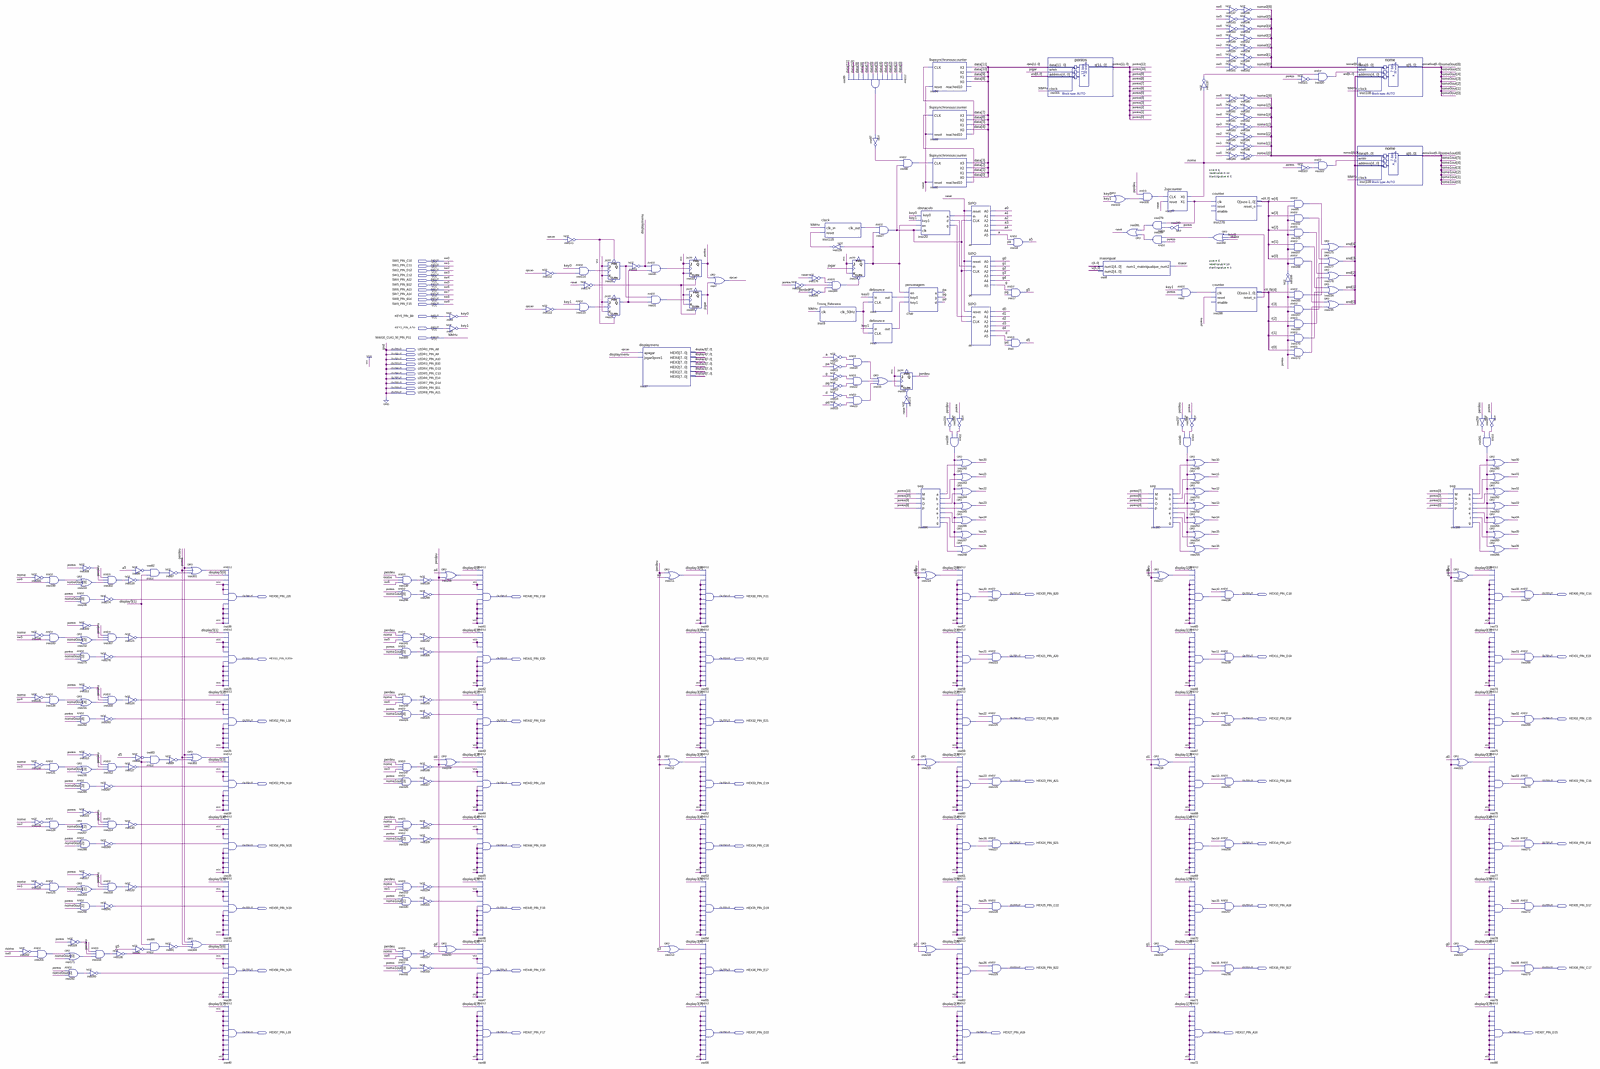
[diagram p0: schematic sheet, whole]
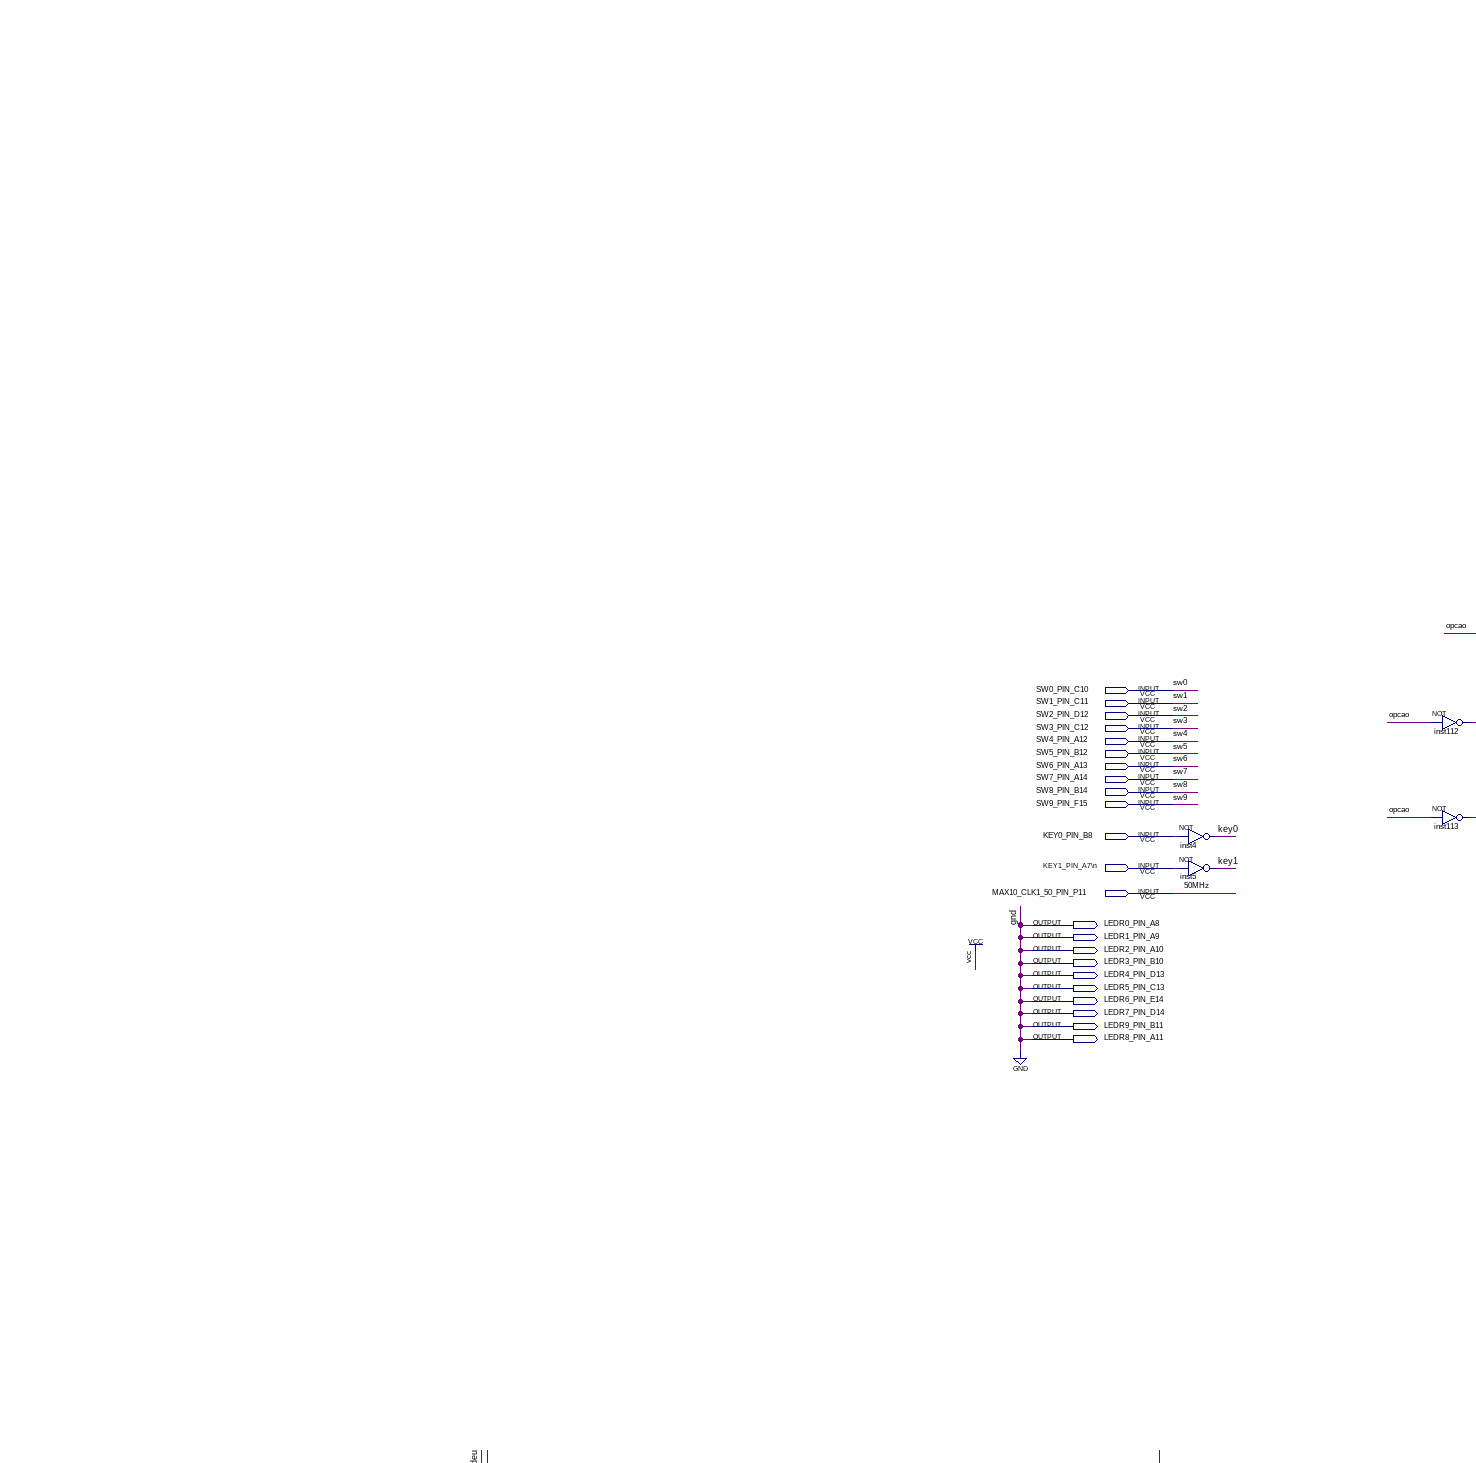
[diagram p1: schematic sheet, upper left part]
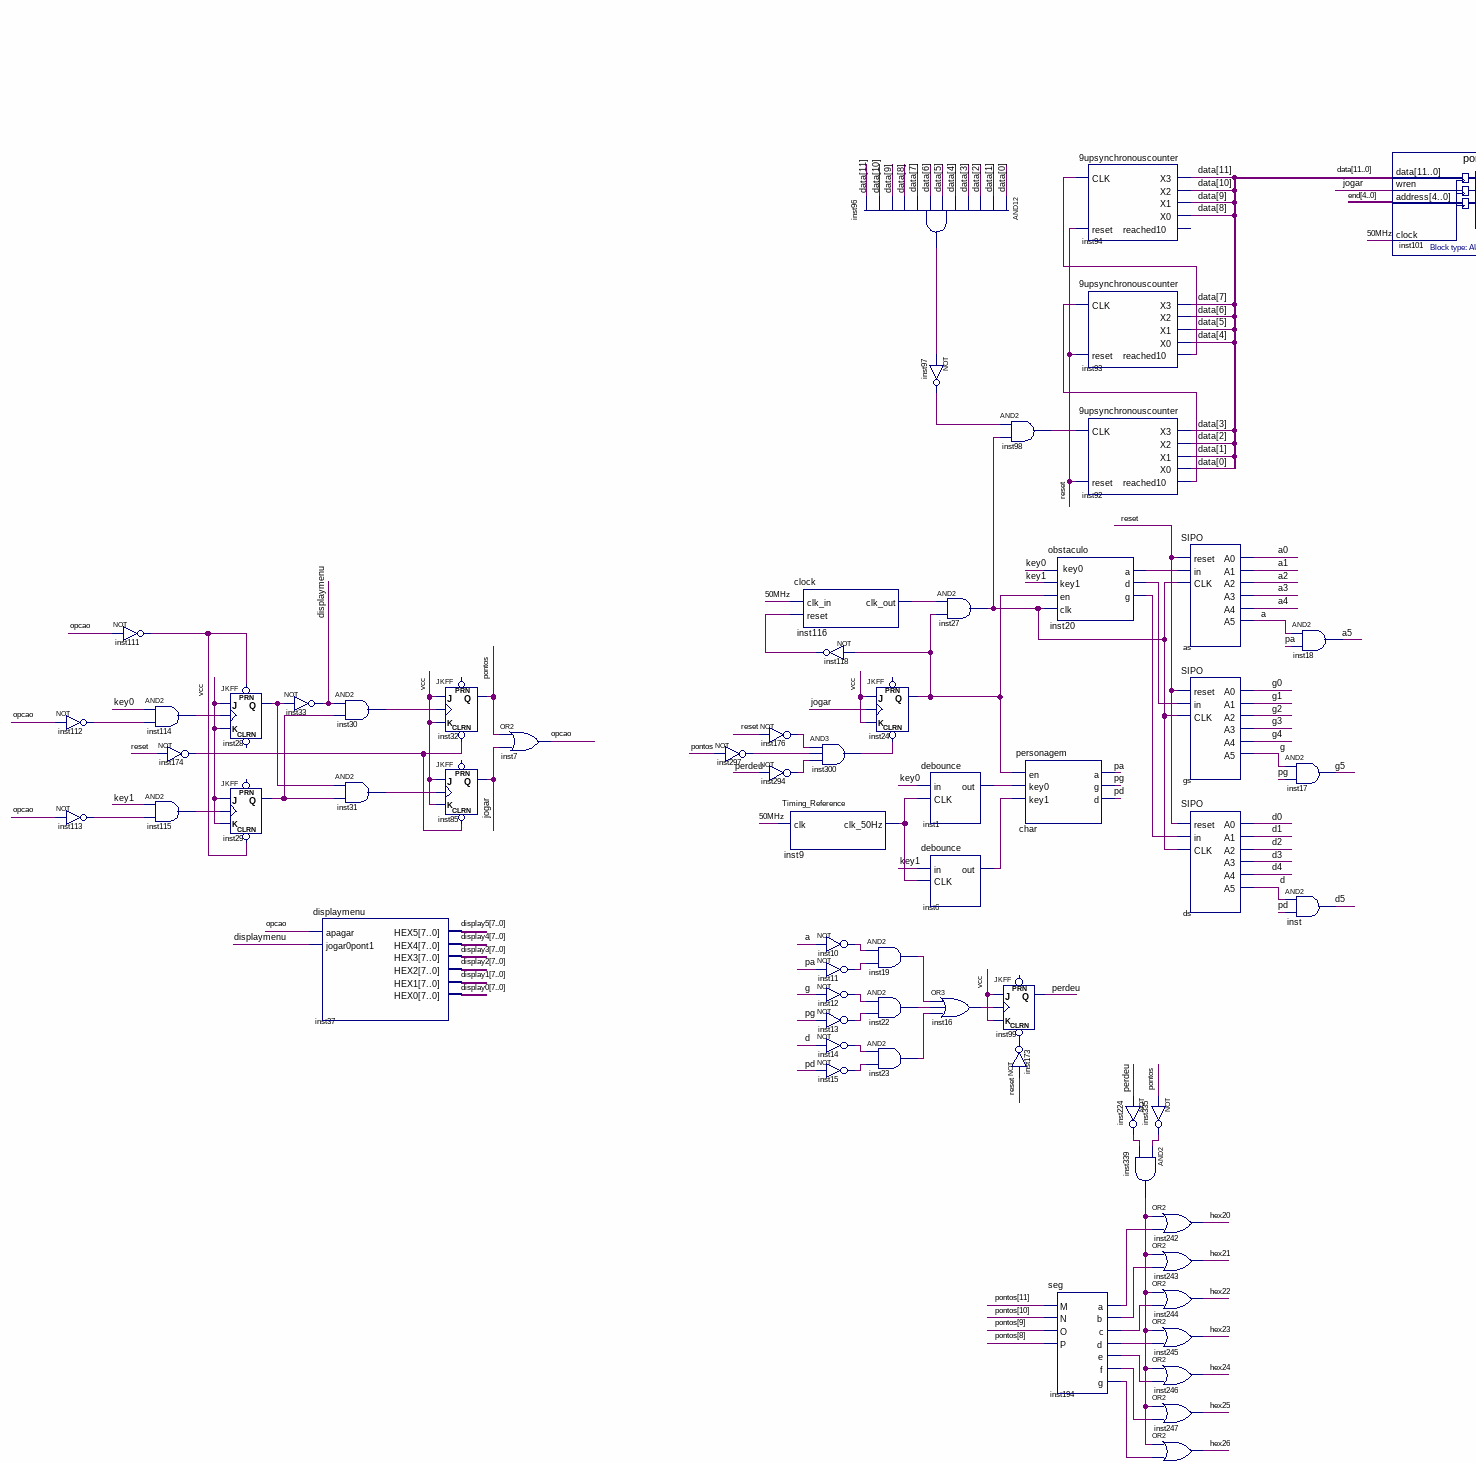
[diagram p2: schematic sheet, upper centre part]
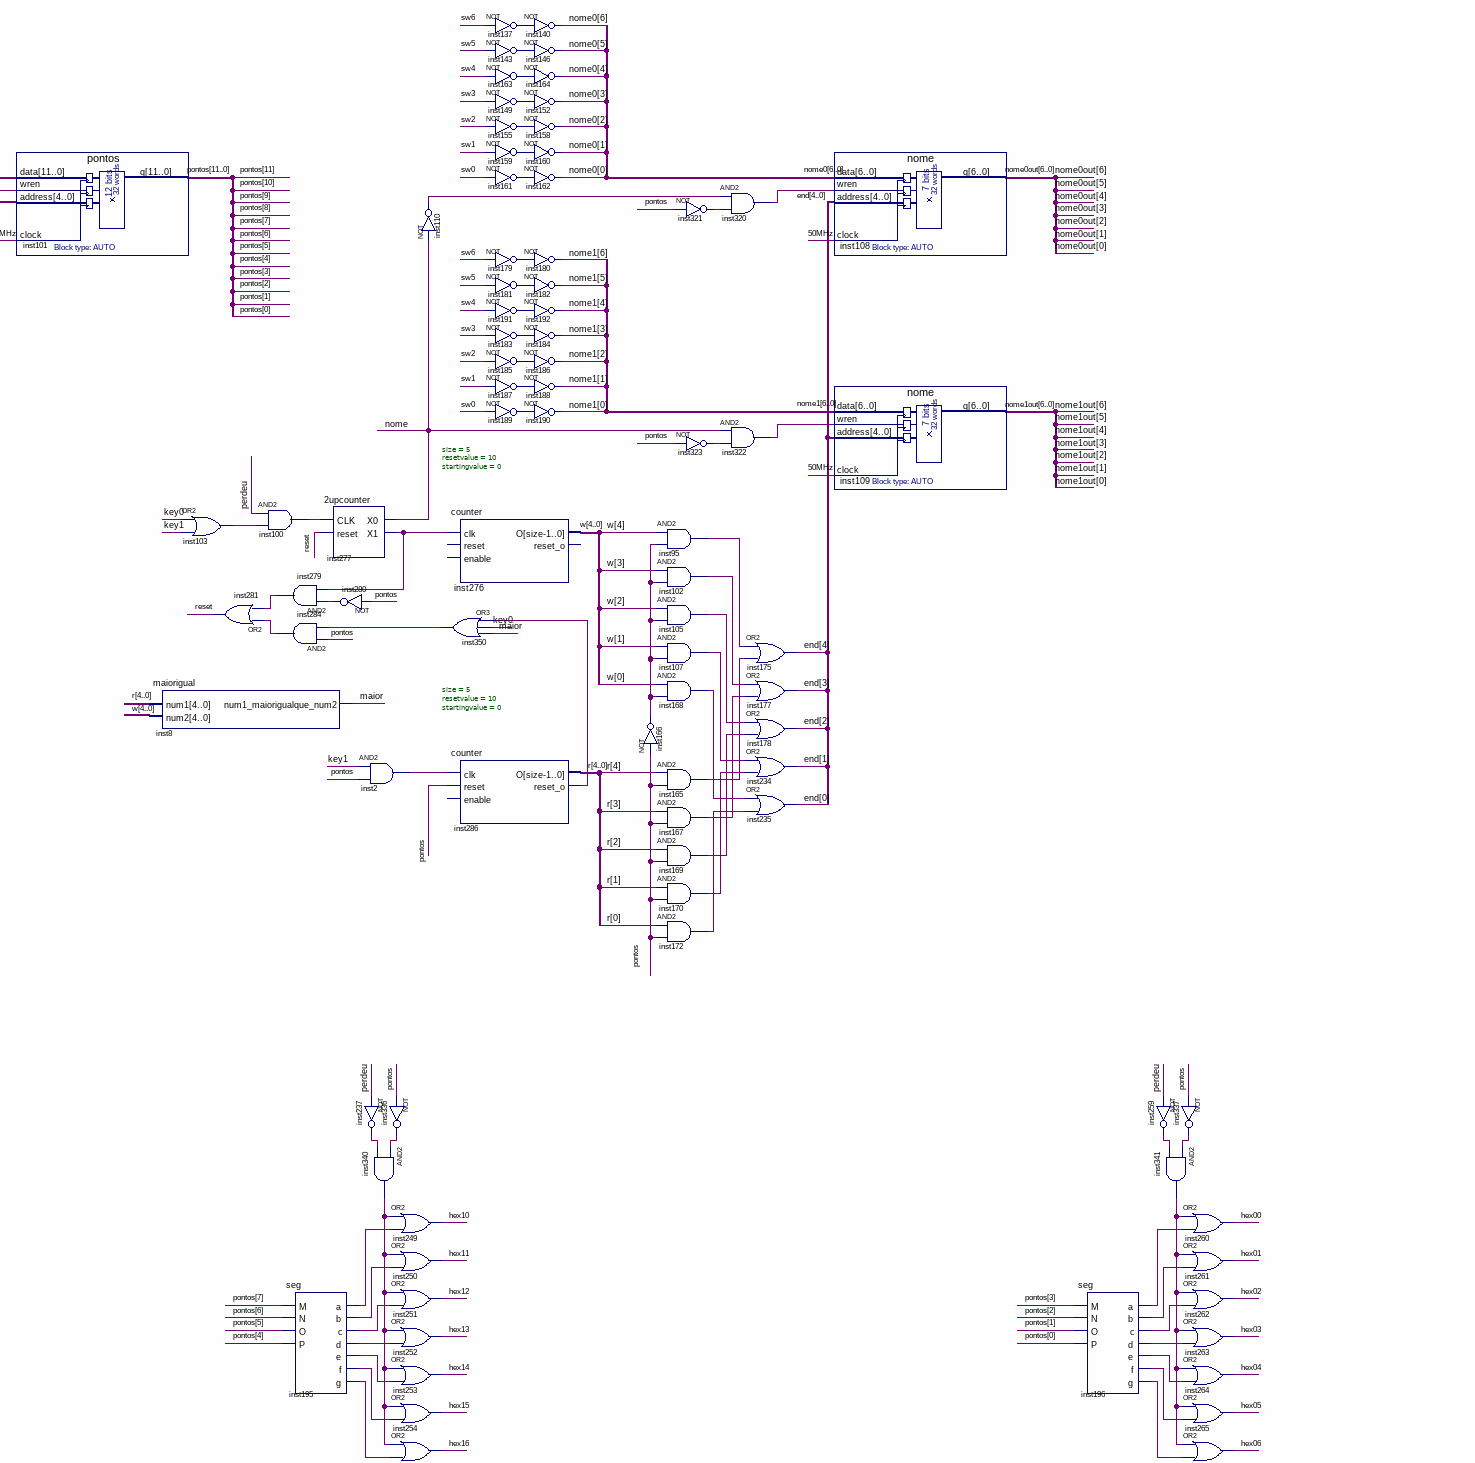
[diagram p3: schematic sheet, upper right part]
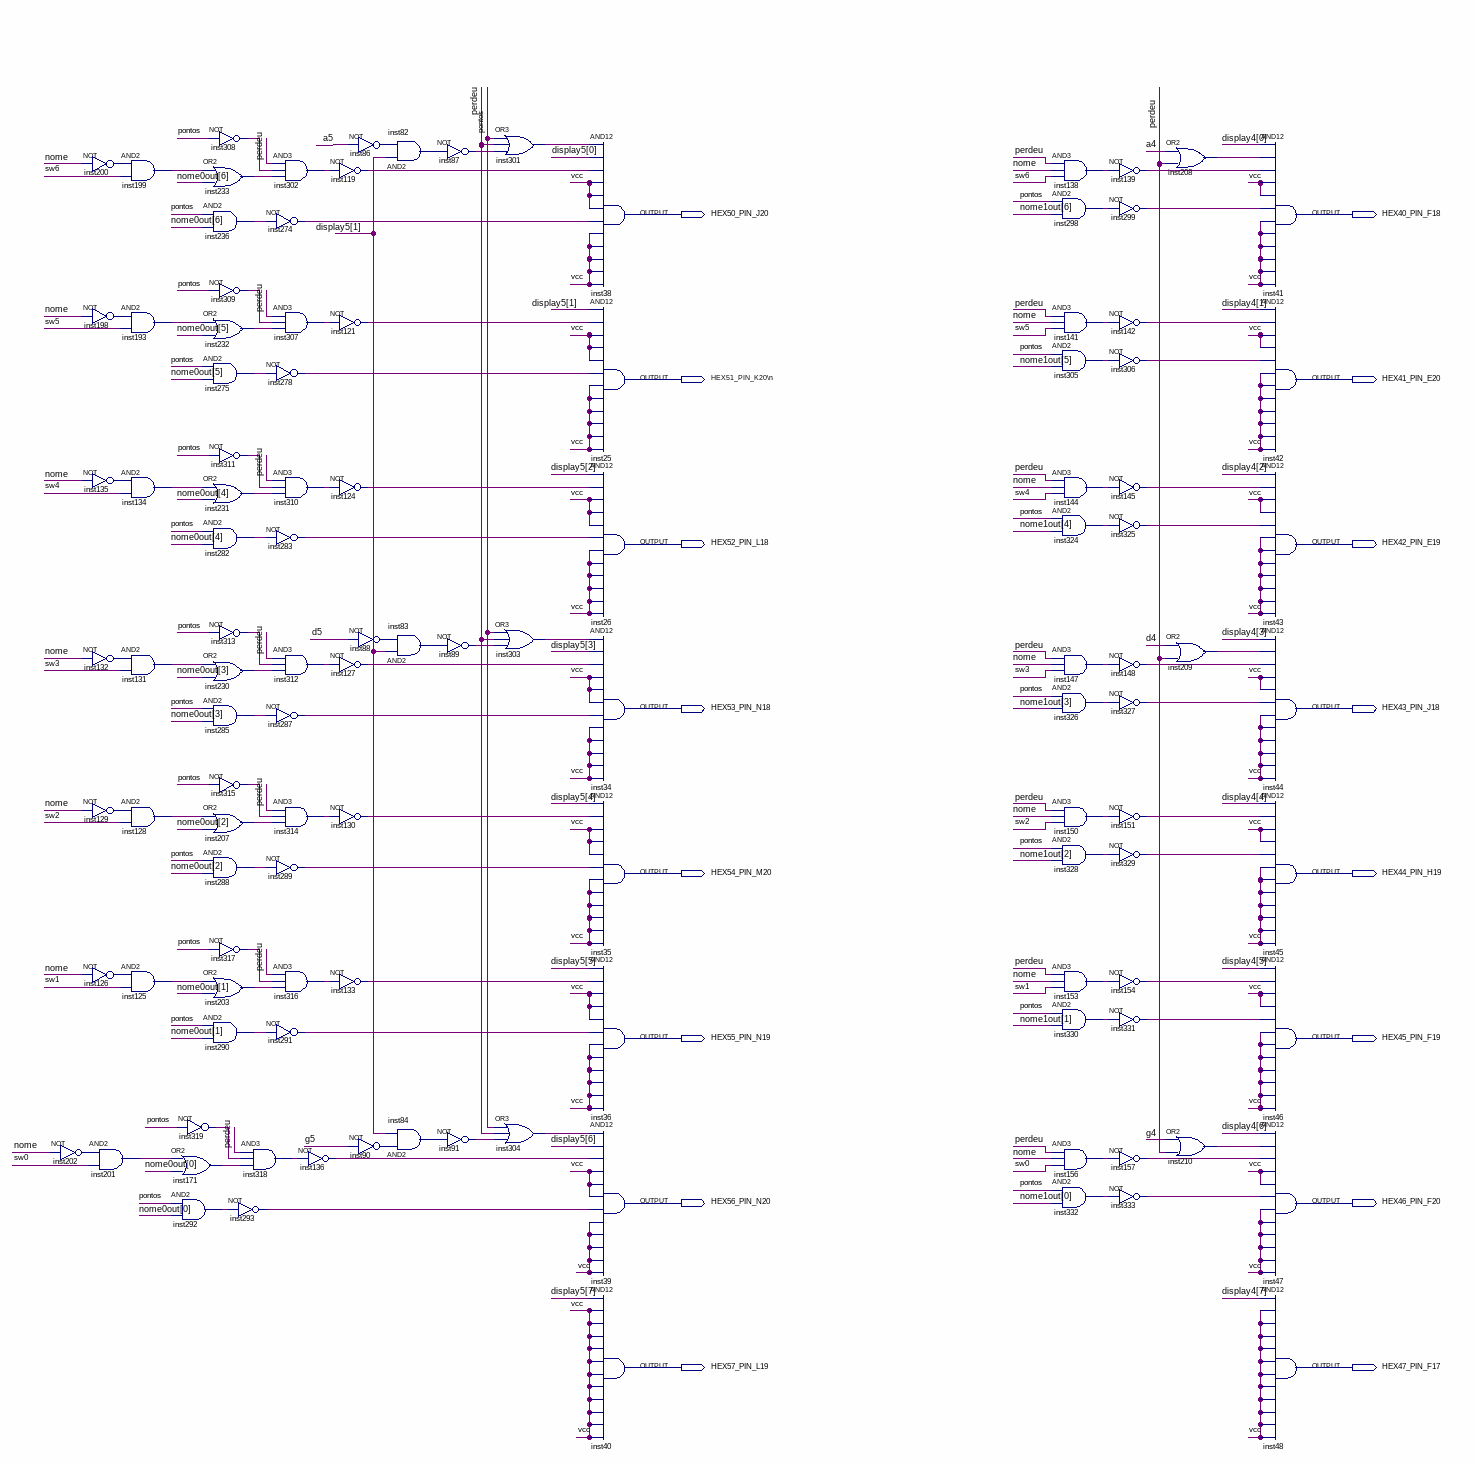
[diagram p4: schematic sheet, lower left part]
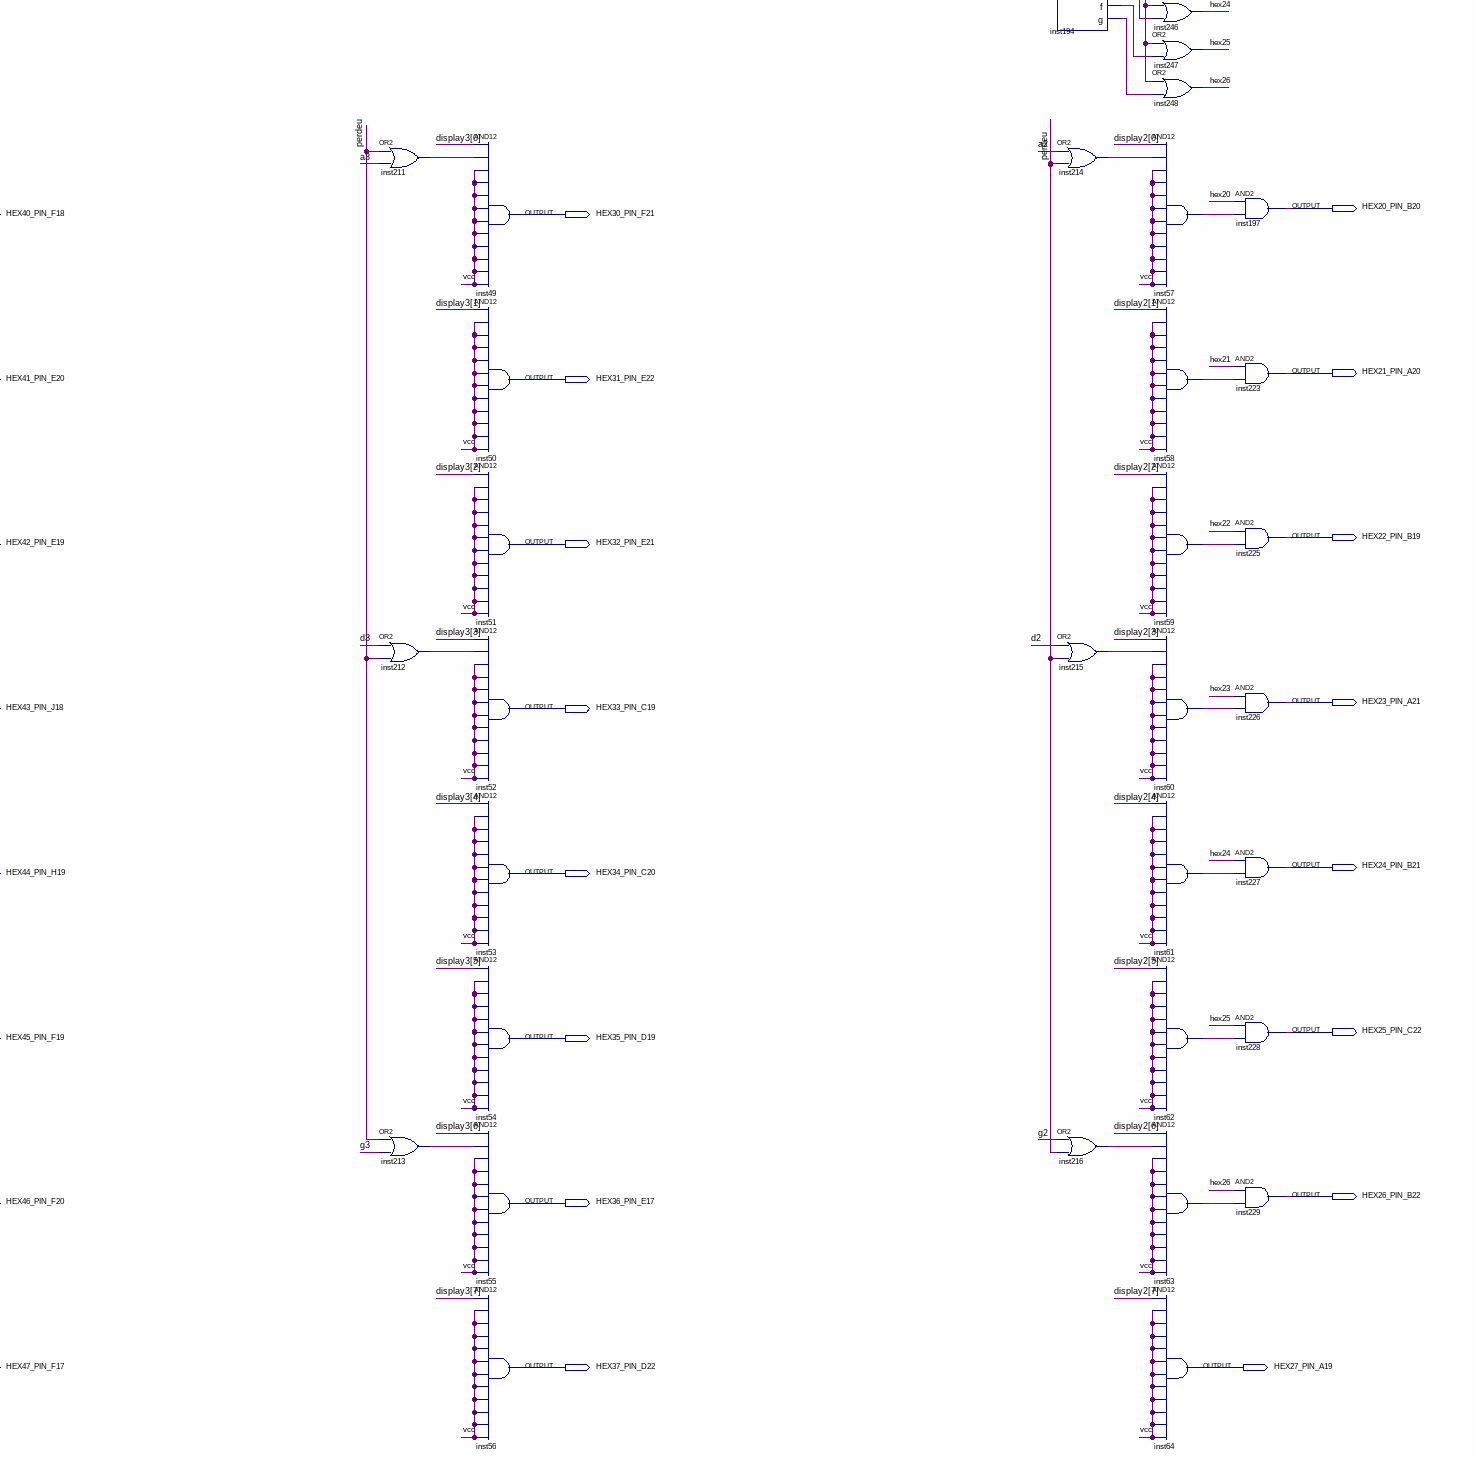
[diagram p5: schematic sheet, lower centre part]
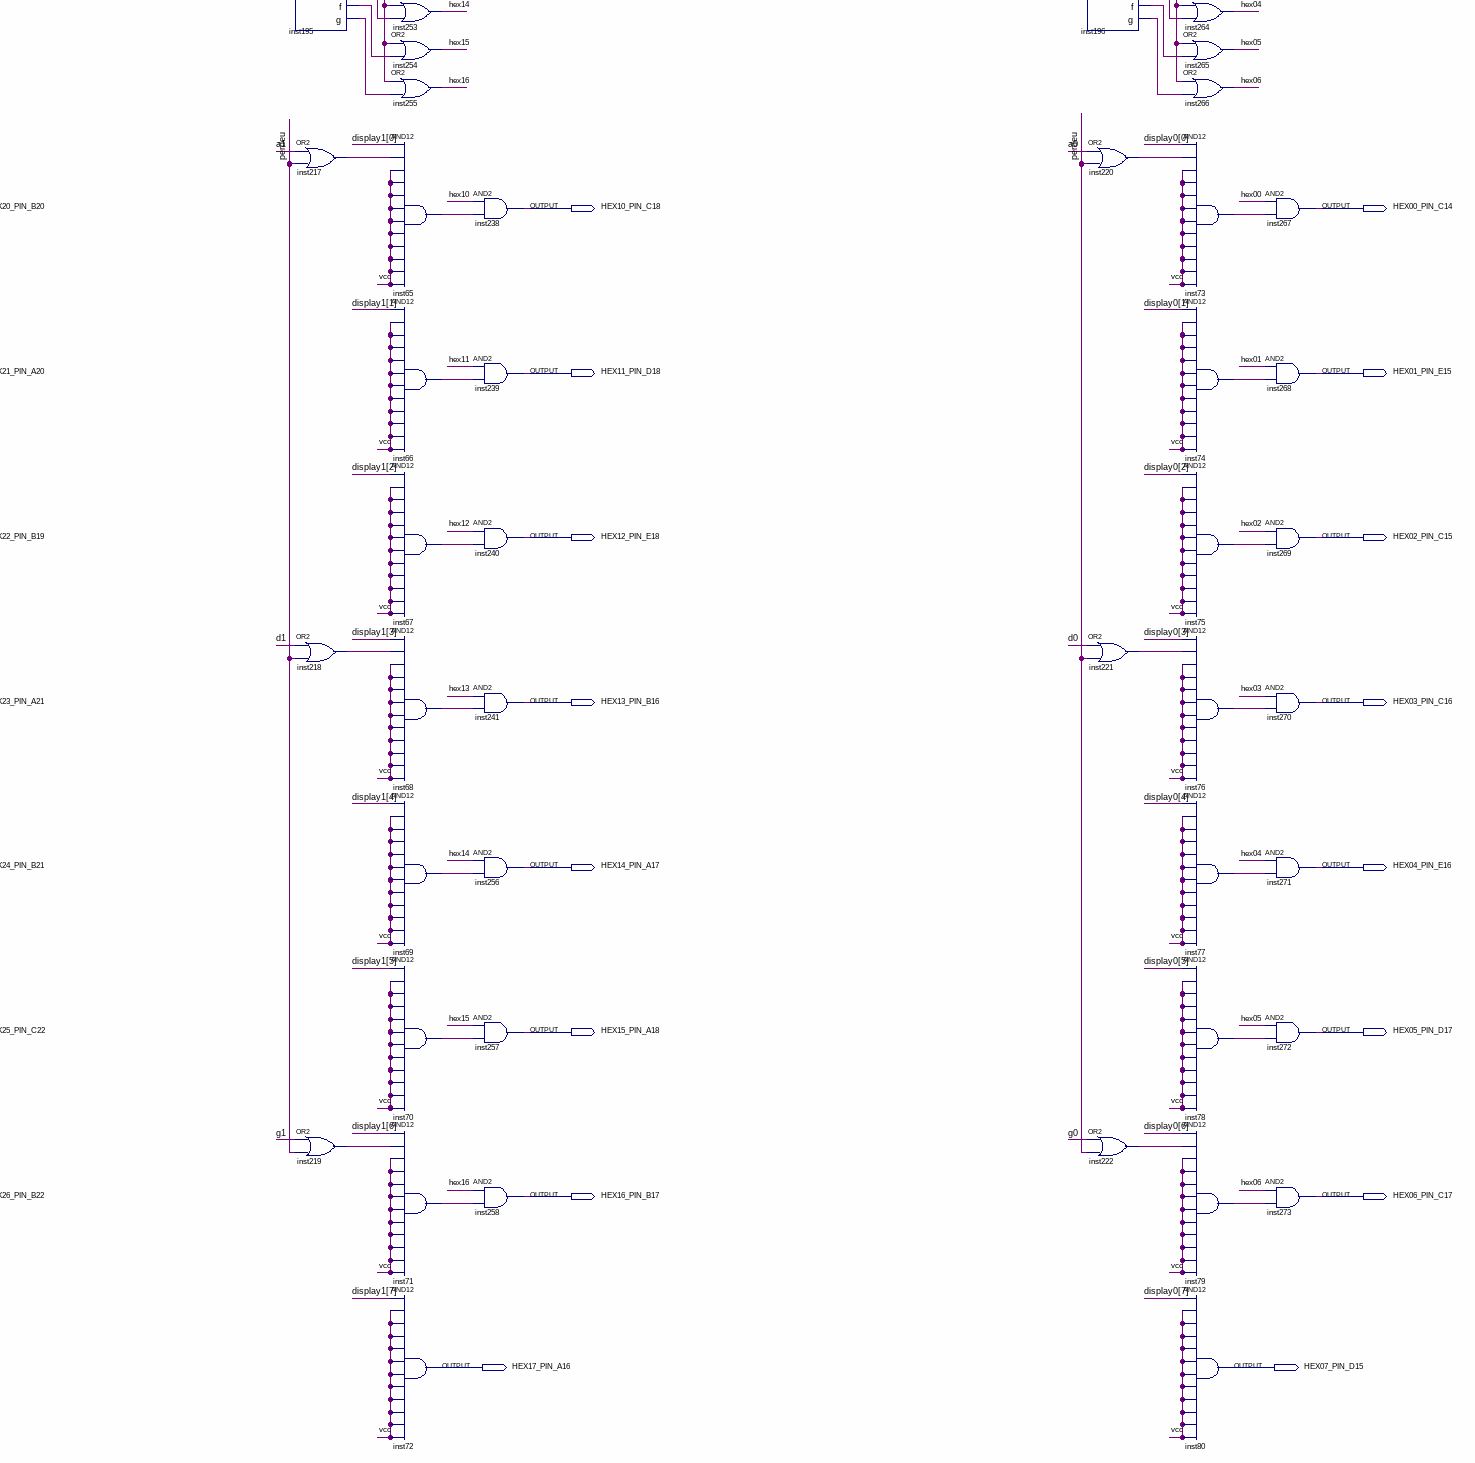
[diagram p6: schematic sheet, lower right part]
// Quartus schematic projfinal.bdf as structural Verilog: 331 symbols, 71 pins
module projfinal (
  input  SW0_PIN_C10,
  input  SW1_PIN_C11,
  input  SW2_PIN_D12,
  input  SW3_PIN_C12,
  input  SW4_PIN_A12,
  input  SW5_PIN_B12,
  input  SW6_PIN_A13,
  input  SW7_PIN_A14,
  input  SW8_PIN_B14,
  input  SW9_PIN_F15,
  input  KEY0_PIN_B8,
  input  \KEY1_PIN_A7\n ,
  input  MAX10_CLK1_50_PIN_P11,
  output LEDR0_PIN_A8,
  output LEDR1_PIN_A9,
  output LEDR2_PIN_A10,
  output LEDR3_PIN_B10,
  output LEDR4_PIN_D13,
  output LEDR5_PIN_C13,
  output LEDR6_PIN_E14,
  output LEDR7_PIN_D14,
  output LEDR9_PIN_B11,
  output LEDR8_PIN_A11,
  output HEX20_PIN_B20,
  output HEX10_PIN_C18,
  output HEX00_PIN_C14,
  output HEX50_PIN_J20,
  output HEX40_PIN_F18,
  output HEX30_PIN_F21,
  output HEX21_PIN_A20,
  output HEX11_PIN_D18,
  output HEX01_PIN_E15,
  output \HEX51_PIN_K20\n ,
  output HEX41_PIN_E20,
  output HEX31_PIN_E22,
  output HEX22_PIN_B19,
  output HEX12_PIN_E18,
  output HEX02_PIN_C15,
  output HEX52_PIN_L18,
  output HEX42_PIN_E19,
  output HEX32_PIN_E21,
  output HEX23_PIN_A21,
  output HEX13_PIN_B16,
  output HEX03_PIN_C16,
  output HEX53_PIN_N18,
  output HEX43_PIN_J18,
  output HEX33_PIN_C19,
  output HEX24_PIN_B21,
  output HEX14_PIN_A17,
  output HEX04_PIN_E16,
  output HEX54_PIN_M20,
  output HEX44_PIN_H19,
  output HEX34_PIN_C20,
  output HEX25_PIN_C22,
  output HEX15_PIN_A18,
  output HEX05_PIN_D17,
  output HEX55_PIN_N19,
  output HEX45_PIN_F19,
  output HEX35_PIN_D19,
  output HEX26_PIN_B22,
  output HEX16_PIN_B17,
  output HEX06_PIN_C17,
  output HEX56_PIN_N20,
  output HEX46_PIN_F20,
  output HEX36_PIN_E17,
  output HEX57_PIN_L19,
  output HEX47_PIN_F17,
  output HEX37_PIN_D22,
  output HEX27_PIN_A19,
  output HEX17_PIN_A16,
  output HEX07_PIN_D15
);

  wire a, a0, a1, a2, a3, a4, a5, d, d0, d1, d2, d3, d4, d5, displaymenu, g, g0, g1, g2, g3, g4, g5, hex00,
       hex01, hex02, hex03, hex04, hex05, hex06, hex10, hex11, hex12, hex13, hex14, hex15, hex16, hex20,
       hex21, hex22, hex23, hex24, hex25, hex26, inst1_out, inst2_out, inst6_out, inst9_clk_50hz, inst10_out,
       inst11_out, inst12_out, inst13_out, inst14_out, inst15_out, inst16_out, inst19_out, inst20_a,
       inst20_d, inst20_g, inst22_out, inst23_out, inst24_q, inst27_out, inst28_q, inst29_q, inst30_out,
       inst31_out, inst57_out, inst58_out, inst59_out, inst60_out, inst61_out, inst62_out, inst63_out,
       inst65_out, inst66_out, inst67_out, inst68_out, inst69_out, inst70_out, inst71_out, inst73_out,
       inst74_out, inst75_out, inst76_out, inst77_out, inst78_out, inst79_out, inst82_out, inst83_out,
       inst84_out, inst86_out, inst87_out, inst88_out, inst89_out, inst90_out, inst91_out, inst92_reached10,
       inst93_reached10, inst95_out, inst96_out, inst97_out, inst98_out, inst100_out, inst102_out,
       inst103_out, inst105_out, inst107_out, inst110_out, inst111_out, inst112_out, inst113_out,
       inst114_out, inst115_out, inst116_clk_out, inst118_out, inst119_out, inst121_out, inst124_out,
       inst125_out, inst126_out, inst127_out, inst128_out, inst129_out, inst130_out, inst131_out,
       inst132_out, inst133_out, inst134_out, inst135_out, inst136_out, inst137_out, inst138_out,
       inst139_out, inst141_out, inst142_out, inst143_out, inst144_out, inst145_out, inst147_out,
       inst148_out, inst149_out, inst150_out, inst151_out, inst153_out, inst154_out, inst155_out,
       inst156_out, inst157_out, inst159_out, inst161_out, inst163_out, inst165_out, inst166_out,
       inst167_out, inst168_out, inst169_out, inst170_out, inst171_out, inst172_out, inst173_out,
       inst174_out, inst176_out, inst179_out, inst181_out, inst183_out, inst185_out, inst187_out,
       inst189_out, inst191_out, inst193_out, inst194_a, inst194_b, inst194_c, inst194_d, inst194_e,
       inst194_f, inst194_g, inst195_a, inst195_b, inst195_c, inst195_d, inst195_e, inst195_f, inst195_g,
       inst196_a, inst196_b, inst196_c, inst196_d, inst196_e, inst196_f, inst196_g, inst198_out, inst199_out,
       inst200_out, inst201_out, inst202_out, inst203_out, inst207_out, inst208_out, inst209_out,
       inst210_out, inst211_out, inst212_out, inst213_out, inst214_out, inst215_out, inst216_out,
       inst217_out, inst218_out, inst219_out, inst220_out, inst221_out, inst222_out, inst224_out,
       inst230_out, inst231_out, inst232_out, inst233_out, inst236_out, inst237_out, inst259_out,
       inst274_out, inst275_out, inst277_x1, inst278_out, inst279_out, inst280_out, inst282_out, inst283_out,
       inst284_out, inst285_out, inst286_reset_o, inst287_out, inst288_out, inst289_out, inst290_out,
       inst291_out, inst292_out, inst293_out, inst294_out, inst297_out, inst298_out, inst299_out,
       inst300_out, inst301_out, inst302_out, inst303_out, inst304_out, inst305_out, inst306_out,
       inst307_out, inst308_out, inst309_out, inst310_out, inst311_out, inst312_out, inst313_out,
       inst314_out, inst315_out, inst316_out, inst317_out, inst318_out, inst319_out, inst320_out,
       inst321_out, inst322_out, inst323_out, inst324_out, inst325_out, inst326_out, inst327_out,
       inst328_out, inst329_out, inst330_out, inst331_out, inst332_out, inst333_out, inst335_out,
       inst336_out, inst337_out, inst339_out, inst340_out, inst341_out, inst350_out, jogar, key0, key1,
       maior, nome, opcao, pa, pd, perdeu, pg, pontos_1bit, reset;
  wire [4:0] \end , r, w;
  wire [6:0] nome0, nome0out, nome1, nome1out;
  wire [7:0] display0, display1, display2, display3, display4, display5;
  wire [11:0] data, pontos;

  not inst200 (inst200_out, nome);
  not inst198 (inst198_out, nome);
  not inst135 (inst135_out, nome);
  not inst132 (inst132_out, nome);
  not inst129 (inst129_out, nome);
  not inst126 (inst126_out, nome);
  not inst202 (inst202_out, nome);
  and inst199 (inst199_out, inst200_out, SW6_PIN_A13);
  and inst193 (inst193_out, inst198_out, SW5_PIN_B12);
  and inst134 (inst134_out, inst135_out, SW4_PIN_A12);
  and inst131 (inst131_out, inst132_out, SW3_PIN_C12);
  and inst128 (inst128_out, inst129_out, SW2_PIN_D12);
  and inst125 (inst125_out, inst126_out, SW1_PIN_C11);
  and inst201 (inst201_out, inst202_out, SW0_PIN_C10);
  not inst319 (inst319_out, pontos_1bit);
  or inst171 (inst171_out, inst201_out, nome0out[0]);
  and inst292 (inst292_out, pontos_1bit, nome0out[0]);
  not inst308 (inst308_out, pontos_1bit);
  or inst233 (inst233_out, inst199_out, nome0out[6]);
  and inst236 (inst236_out, pontos_1bit, nome0out[6]);
  not inst309 (inst309_out, pontos_1bit);
  or inst232 (inst232_out, inst193_out, nome0out[5]);
  and inst275 (inst275_out, pontos_1bit, nome0out[5]);
  not inst311 (inst311_out, pontos_1bit);
  or inst231 (inst231_out, inst134_out, nome0out[4]);
  and inst282 (inst282_out, pontos_1bit, nome0out[4]);
  not inst313 (inst313_out, pontos_1bit);
  or inst230 (inst230_out, inst131_out, nome0out[3]);
  and inst285 (inst285_out, pontos_1bit, nome0out[3]);
  not inst315 (inst315_out, pontos_1bit);
  or inst207 (inst207_out, inst128_out, nome0out[2]);
  and inst288 (inst288_out, pontos_1bit, nome0out[2]);
  not inst317 (inst317_out, pontos_1bit);
  or inst203 (inst203_out, inst125_out, nome0out[1]);
  and inst290 (inst290_out, pontos_1bit, nome0out[1]);
  not inst293 (inst293_out, inst292_out);
  and inst302 (inst302_out, perdeu, inst308_out, inst233_out);
  not inst274 (inst274_out, inst236_out);
  and inst307 (inst307_out, perdeu, inst309_out, inst232_out);
  not inst278 (inst278_out, inst275_out);
  and inst310 (inst310_out, perdeu, inst311_out, inst231_out);
  not inst283 (inst283_out, inst282_out);
  and inst312 (inst312_out, perdeu, inst313_out, inst230_out);
  not inst287 (inst287_out, inst285_out);
  and inst314 (inst314_out, perdeu, inst315_out, inst207_out);
  not inst289 (inst289_out, inst288_out);
  and inst316 (inst316_out, perdeu, inst317_out, inst203_out);
  not inst291 (inst291_out, inst290_out);
  and inst318 (inst318_out, perdeu, inst319_out, inst171_out);
  not inst119 (inst119_out, inst302_out);
  not inst121 (inst121_out, inst307_out);
  not inst124 (inst124_out, inst310_out);
  not inst127 (inst127_out, inst312_out);
  not inst130 (inst130_out, inst314_out);
  not inst133 (inst133_out, inst316_out);
  not inst136 (inst136_out, inst318_out);
  and inst82 (inst82_out, display5[1], inst86_out);
  not inst86 (inst86_out, a5);
  and inst83 (inst83_out, display5[1], inst88_out);
  not inst88 (inst88_out, d5);
  and inst84 (inst84_out, inst90_out, display5[1]);
  not inst90 (inst90_out, g5);
  not inst87 (inst87_out, inst82_out);
  not inst89 (inst89_out, inst83_out);
  not inst91 (inst91_out, inst84_out);
  or inst301 (inst301_out, pontos_1bit, perdeu, inst87_out);
  or inst303 (inst303_out, pontos_1bit, perdeu, inst89_out);
  or inst304 (inst304_out, pontos_1bit, perdeu, inst91_out);
  and inst38 (HEX50_PIN_J20, inst301_out, display5[0], inst119_out, 1'b1, 1'b1, 1'b1, inst274_out, 1'b1, 1'b1, 1'b1, 1'b1, 1'b1);
  and inst25 (\HEX51_PIN_K20\n , display5[1], inst121_out, 1'b1, 1'b1, 1'b1, inst278_out, 1'b1, 1'b1, 1'b1, 1'b1, 1'b1, 1'b1);
  and inst26 (HEX52_PIN_L18, display5[2], inst124_out, 1'b1, 1'b1, 1'b1, inst283_out, 1'b1, 1'b1, 1'b1, 1'b1, 1'b1, 1'b1);
  and inst34 (HEX53_PIN_N18, inst303_out, display5[3], inst127_out, 1'b1, 1'b1, 1'b1, inst287_out, 1'b1, 1'b1, 1'b1, 1'b1, 1'b1);
  and inst35 (HEX54_PIN_M20, display5[4], inst130_out, 1'b1, 1'b1, 1'b1, inst289_out, 1'b1, 1'b1, 1'b1, 1'b1, 1'b1, 1'b1);
  and inst36 (HEX55_PIN_N19, display5[5], inst133_out, 1'b1, 1'b1, 1'b1, inst291_out, 1'b1, 1'b1, 1'b1, 1'b1, 1'b1, 1'b1);
  and inst39 (HEX56_PIN_N20, inst304_out, display5[6], inst136_out, 1'b1, 1'b1, 1'b1, inst293_out, 1'b1, 1'b1, 1'b1, 1'b1, 1'b1);
  and inst40 (HEX57_PIN_L19, display5[7], 1'b1, 1'b1, 1'b1, 1'b1, 1'b1, 1'b1, 1'b1, 1'b1, 1'b1, 1'b1, 1'b1);
  and inst138 (inst138_out, perdeu, nome, SW6_PIN_A13);
  and inst298 (inst298_out, pontos_1bit, nome1out[6]);
  and inst141 (inst141_out, perdeu, nome, SW5_PIN_B12);
  and inst305 (inst305_out, pontos_1bit, nome1out[5]);
  and inst144 (inst144_out, perdeu, nome, SW4_PIN_A12);
  and inst324 (inst324_out, pontos_1bit, nome1out[4]);
  and inst147 (inst147_out, perdeu, nome, SW3_PIN_C12);
  and inst326 (inst326_out, pontos_1bit, nome1out[3]);
  and inst150 (inst150_out, perdeu, nome, SW2_PIN_D12);
  and inst328 (inst328_out, pontos_1bit, nome1out[2]);
  and inst153 (inst153_out, perdeu, nome, SW1_PIN_C11);
  and inst330 (inst330_out, pontos_1bit, nome1out[1]);
  and inst156 (inst156_out, perdeu, nome, SW0_PIN_C10);
  and inst332 (inst332_out, pontos_1bit, nome1out[0]);
  not inst139 (inst139_out, inst138_out);
  not inst299 (inst299_out, inst298_out);
  not inst142 (inst142_out, inst141_out);
  not inst306 (inst306_out, inst305_out);
  not inst145 (inst145_out, inst144_out);
  not inst325 (inst325_out, inst324_out);
  not inst148 (inst148_out, inst147_out);
  not inst327 (inst327_out, inst326_out);
  not inst151 (inst151_out, inst150_out);
  not inst329 (inst329_out, inst328_out);
  not inst154 (inst154_out, inst153_out);
  not inst331 (inst331_out, inst330_out);
  not inst157 (inst157_out, inst156_out);
  not inst333 (inst333_out, inst332_out);
  not inst4 (key0, KEY0_PIN_B8);
  not inst5 (key1, \KEY1_PIN_A7\n );
  or inst208 (inst208_out, a4, perdeu);
  or inst209 (inst209_out, d4, perdeu);
  or inst210 (inst210_out, g4, perdeu);
  and inst41 (HEX40_PIN_F18, display4[0], inst208_out, inst139_out, 1'b1, 1'b1, inst299_out, 1'b1, 1'b1, 1'b1, 1'b1, 1'b1, 1'b1);
  and inst42 (HEX41_PIN_E20, display4[1], inst142_out, 1'b1, 1'b1, inst306_out, 1'b1, 1'b1, 1'b1, 1'b1, 1'b1, 1'b1, 1'b1);
  and inst43 (HEX42_PIN_E19, display4[2], inst145_out, 1'b1, 1'b1, inst325_out, 1'b1, 1'b1, 1'b1, 1'b1, 1'b1, 1'b1, 1'b1);
  and inst44 (HEX43_PIN_J18, display4[3], inst209_out, inst148_out, 1'b1, 1'b1, inst327_out, 1'b1, 1'b1, 1'b1, 1'b1, 1'b1, 1'b1);
  and inst45 (HEX44_PIN_H19, display4[4], inst151_out, 1'b1, 1'b1, inst329_out, 1'b1, 1'b1, 1'b1, 1'b1, 1'b1, 1'b1, 1'b1);
  and inst46 (HEX45_PIN_F19, display4[5], inst154_out, 1'b1, 1'b1, inst331_out, 1'b1, 1'b1, 1'b1, 1'b1, 1'b1, 1'b1, 1'b1);
  and inst47 (HEX46_PIN_F20, display4[6], inst210_out, inst157_out, 1'b1, 1'b1, inst333_out, 1'b1, 1'b1, 1'b1, 1'b1, 1'b1, 1'b1);
  and inst48 (HEX47_PIN_F17, display4[7], 1'b1, 1'b1, 1'b1, 1'b1, 1'b1, 1'b1, 1'b1, 1'b1, 1'b1, 1'b1, 1'b1);
  not inst112 (inst112_out, opcao);
  not inst113 (inst113_out, opcao);
  not inst111 (inst111_out, opcao);
  and inst114 (inst114_out, key0, inst112_out);
  not inst174 (inst174_out, reset);
  and inst115 (inst115_out, key1, inst113_out);
  JKFF inst28 (.PRN(inst111_out), .K(1'b1), .J(1'b1), .CLK(inst114_out), .Q(inst28_q));  // open: CLRN
  JKFF inst29 (.CLRN(inst111_out), .K(1'b1), .J(1'b1), .CLK(inst115_out), .Q(inst29_q));  // open: PRN
  not inst33 (displaymenu, inst28_q);
  displaymenu inst37 (
    .apagar(opcao), .jogar0pont1(displaymenu), .HEX5(display5), .HEX4(display4), .HEX3(display3),
    .HEX2(display2), .HEX1(display1), .HEX0(display0));
  and inst30 (inst30_out, displaymenu, inst29_q);
  and inst31 (inst31_out, inst28_q, inst29_q);
  or inst211 (inst211_out, perdeu, a3);
  or inst212 (inst212_out, d3, perdeu);
  or inst213 (inst213_out, perdeu, g3);
  JKFF inst32 (.CLRN(inst174_out), .K(1'b1), .J(1'b1), .CLK(inst30_out), .Q(pontos_1bit));  // open: PRN
  JKFF inst85 (.CLRN(inst174_out), .K(1'b1), .J(1'b1), .CLK(inst31_out), .Q(jogar));  // open: PRN
  and inst49 (HEX30_PIN_F21, display3[0], inst211_out, 1'b1, 1'b1, 1'b1, 1'b1, 1'b1, 1'b1, 1'b1, 1'b1, 1'b1, 1'b1);
  and inst50 (HEX31_PIN_E22, display3[1], 1'b1, 1'b1, 1'b1, 1'b1, 1'b1, 1'b1, 1'b1, 1'b1, 1'b1, 1'b1, 1'b1);
  and inst51 (HEX32_PIN_E21, display3[2], 1'b1, 1'b1, 1'b1, 1'b1, 1'b1, 1'b1, 1'b1, 1'b1, 1'b1, 1'b1, 1'b1);
  and inst52 (HEX33_PIN_C19, display3[3], inst212_out, 1'b1, 1'b1, 1'b1, 1'b1, 1'b1, 1'b1, 1'b1, 1'b1, 1'b1, 1'b1);
  and inst53 (HEX34_PIN_C20, display3[4], 1'b1, 1'b1, 1'b1, 1'b1, 1'b1, 1'b1, 1'b1, 1'b1, 1'b1, 1'b1, 1'b1);
  and inst54 (HEX35_PIN_D19, display3[5], 1'b1, 1'b1, 1'b1, 1'b1, 1'b1, 1'b1, 1'b1, 1'b1, 1'b1, 1'b1, 1'b1);
  and inst55 (HEX36_PIN_E17, display3[6], inst213_out, 1'b1, 1'b1, 1'b1, 1'b1, 1'b1, 1'b1, 1'b1, 1'b1, 1'b1, 1'b1);
  and inst56 (HEX37_PIN_D22, display3[7], 1'b1, 1'b1, 1'b1, 1'b1, 1'b1, 1'b1, 1'b1, 1'b1, 1'b1, 1'b1, 1'b1);
  or inst7 (opcao, pontos_1bit, jogar);
  not inst297 (inst297_out, pontos_1bit);
  not inst176 (inst176_out, reset);
  not inst294 (inst294_out, perdeu);
  Timing_Reference inst9 (.clk(MAX10_CLK1_50_PIN_P11), .clk_50Hz(inst9_clk_50hz));
  clock inst116 (.clk_in(MAX10_CLK1_50_PIN_P11), .reset(inst118_out), .clk_out(inst116_clk_out));
  not inst118 (inst118_out, inst24_q);
  and inst300 (inst300_out, inst176_out, inst297_out, inst294_out);
  not inst10 (inst10_out, a);
  not inst11 (inst11_out, pa);
  not inst12 (inst12_out, g);
  not inst13 (inst13_out, pg);
  not inst14 (inst14_out, d);
  not inst15 (inst15_out, pd);
  and inst96 (inst96_out, data[0], data[1], data[2], data[3], data[4], data[5], data[6], data[7], data[8], data[9], data[10], data[11]);
  JKFF inst24 (.CLRN(inst300_out), .K(1'b1), .J(1'b1), .CLK(jogar), .Q(inst24_q));  // open: PRN
  and inst19 (inst19_out, inst10_out, inst11_out);
  and inst22 (inst22_out, inst12_out, inst13_out);
  and inst23 (inst23_out, inst14_out, inst15_out);
  not inst97 (inst97_out, inst96_out);
  and inst27 (inst27_out, inst116_clk_out, inst24_q);
  debounce inst1 (.in(key0), .CLK(inst9_clk_50hz), .out(inst1_out));
  debounce inst6 (.in(key1), .CLK(inst9_clk_50hz), .out(inst6_out));
  or inst16 (inst16_out, inst19_out, inst22_out, inst23_out);
  and inst98 (inst98_out, inst97_out, inst27_out);
  personagem char (.en(inst24_q), .key0(inst1_out), .key1(inst6_out), .a(pa), .d(pd), .g(pg));
  JKFF inst99 (.CLRN(inst173_out), .K(1'b1), .J(1'b1), .CLK(inst16_out), .Q(perdeu));  // open: PRN
  not inst173 (inst173_out, reset);
  \9upsynchronouscounter  inst94 (
    .CLK(inst93_reached10), .reset(reset), .X0(data[8]), .X1(data[9]), .X2(data[10]), .X3(data[11]));  // open: reached10
  \9upsynchronouscounter  inst93 (
    .CLK(inst92_reached10), .reset(reset), .X0(data[4]), .X1(data[5]), .X2(data[6]), .X3(data[7]),
    .reached10(inst93_reached10));
  \9upsynchronouscounter  inst92 (
    .CLK(inst98_out), .reset(reset), .X0(data[0]), .X1(data[1]), .X2(data[2]), .X3(data[3]),
    .reached10(inst92_reached10));
  obstaculo inst20 (
    .en(inst24_q), .clk(inst27_out), .key0(key0), .key1(key1), .a(inst20_a), .d(inst20_d), .g(inst20_g));
  seg inst194 (
    .M(pontos[11]), .N(pontos[10]), .O(pontos[9]), .P(pontos[8]), .a(inst194_a), .b(inst194_b),
    .c(inst194_c), .d(inst194_d), .e(inst194_e), .f(inst194_f), .g(inst194_g));
  or inst214 (inst214_out, a2, perdeu);
  or inst215 (inst215_out, d2, perdeu);
  or inst216 (inst216_out, g2, perdeu);
  not inst224 (inst224_out, perdeu);
  and inst339 (inst339_out, inst335_out, inst224_out);
  SIPO as (.reset(reset), .in(inst20_a), .CLK(inst27_out), .A0(a0), .A1(a1), .A2(a2), .A3(a3), .A4(a4), .A5(a));
  SIPO gs (.reset(reset), .in(inst20_d), .CLK(inst27_out), .A0(g0), .A1(g1), .A2(g2), .A3(g3), .A4(g4), .A5(g));
  SIPO ds (.reset(reset), .in(inst20_g), .CLK(inst27_out), .A0(d0), .A1(d1), .A2(d2), .A3(d3), .A4(d4), .A5(d));
  not inst335 (inst335_out, pontos_1bit);
  or inst242 (hex20, inst339_out, inst194_a);
  or inst243 (hex21, inst339_out, inst194_b);
  or inst244 (hex22, inst339_out, inst194_c);
  or inst245 (hex23, inst339_out, inst194_d);
  or inst246 (hex24, inst339_out, inst194_e);
  or inst247 (hex25, inst339_out, inst194_f);
  or inst248 (hex26, inst339_out, inst194_g);
  and inst57 (inst57_out, display2[0], inst214_out, 1'b1, 1'b1, 1'b1, 1'b1, 1'b1, 1'b1, 1'b1, 1'b1, 1'b1, 1'b1);
  and inst58 (inst58_out, display2[1], 1'b1, 1'b1, 1'b1, 1'b1, 1'b1, 1'b1, 1'b1, 1'b1, 1'b1, 1'b1, 1'b1);
  and inst59 (inst59_out, display2[2], 1'b1, 1'b1, 1'b1, 1'b1, 1'b1, 1'b1, 1'b1, 1'b1, 1'b1, 1'b1, 1'b1);
  and inst60 (inst60_out, display2[3], inst215_out, 1'b1, 1'b1, 1'b1, 1'b1, 1'b1, 1'b1, 1'b1, 1'b1, 1'b1, 1'b1);
  and inst61 (inst61_out, display2[4], 1'b1, 1'b1, 1'b1, 1'b1, 1'b1, 1'b1, 1'b1, 1'b1, 1'b1, 1'b1, 1'b1);
  and inst62 (inst62_out, display2[5], 1'b1, 1'b1, 1'b1, 1'b1, 1'b1, 1'b1, 1'b1, 1'b1, 1'b1, 1'b1, 1'b1);
  and inst63 (inst63_out, display2[6], inst216_out, 1'b1, 1'b1, 1'b1, 1'b1, 1'b1, 1'b1, 1'b1, 1'b1, 1'b1, 1'b1);
  and inst64 (HEX27_PIN_A19, display2[7], 1'b1, 1'b1, 1'b1, 1'b1, 1'b1, 1'b1, 1'b1, 1'b1, 1'b1, 1'b1, 1'b1);
  and inst197 (HEX20_PIN_B20, hex20, inst57_out);
  and inst223 (HEX21_PIN_A20, hex21, inst58_out);
  and inst225 (HEX22_PIN_B19, hex22, inst59_out);
  and inst226 (HEX23_PIN_A21, hex23, inst60_out);
  and inst227 (HEX24_PIN_B21, hex24, inst61_out);
  and inst228 (HEX25_PIN_C22, hex25, inst62_out);
  and inst229 (HEX26_PIN_B22, hex26, inst63_out);
  and inst18 (a5, a, pa);
  and inst17 (g5, g, pg);
  and inst (d5, d, pd);
  pontos inst101 (.data(data), .wren(jogar), .address(\end ), .clock(MAX10_CLK1_50_PIN_P11), .q(pontos));
  maiorigual inst8 (.num1(r), .num2(w), .num1_maiorigualque_num2(maior));
  or inst103 (inst103_out, key0, key1);
  or inst281 (reset, inst284_out, inst279_out);
  and inst100 (inst100_out, perdeu, inst103_out);
  \2upcounter  inst277 (.CLK(inst100_out), .reset(reset), .X0(nome), .X1(inst277_x1));
  and inst279 (inst279_out, inst280_out, inst277_x1);
  and inst284 (inst284_out, pontos_1bit, inst350_out);
  seg inst195 (
    .M(pontos[7]), .N(pontos[6]), .O(pontos[5]), .P(pontos[4]), .a(inst195_a), .b(inst195_b), .c(inst195_c),
    .d(inst195_d), .e(inst195_e), .f(inst195_f), .g(inst195_g));
  or inst217 (inst217_out, a1, perdeu);
  or inst218 (inst218_out, d1, perdeu);
  or inst219 (inst219_out, g1, perdeu);
  not inst280 (inst280_out, pontos_1bit);
  and inst2 (inst2_out, key1, pontos_1bit);
  not inst237 (inst237_out, perdeu);
  and inst340 (inst340_out, inst336_out, inst237_out);
  not inst110 (inst110_out, nome);
  not inst336 (inst336_out, pontos_1bit);
  or inst249 (hex10, inst340_out, inst195_a);
  or inst250 (hex11, inst340_out, inst195_b);
  or inst251 (hex12, inst340_out, inst195_c);
  or inst252 (hex13, inst340_out, inst195_d);
  or inst253 (hex14, inst340_out, inst195_e);
  or inst254 (hex15, inst340_out, inst195_f);
  or inst255 (hex16, inst340_out, inst195_g);
  and inst65 (inst65_out, display1[0], inst217_out, 1'b1, 1'b1, 1'b1, 1'b1, 1'b1, 1'b1, 1'b1, 1'b1, 1'b1, 1'b1);
  and inst66 (inst66_out, display1[1], 1'b1, 1'b1, 1'b1, 1'b1, 1'b1, 1'b1, 1'b1, 1'b1, 1'b1, 1'b1, 1'b1);
  and inst67 (inst67_out, display1[2], 1'b1, 1'b1, 1'b1, 1'b1, 1'b1, 1'b1, 1'b1, 1'b1, 1'b1, 1'b1, 1'b1);
  and inst68 (inst68_out, display1[3], inst218_out, 1'b1, 1'b1, 1'b1, 1'b1, 1'b1, 1'b1, 1'b1, 1'b1, 1'b1, 1'b1);
  and inst69 (inst69_out, display1[4], 1'b1, 1'b1, 1'b1, 1'b1, 1'b1, 1'b1, 1'b1, 1'b1, 1'b1, 1'b1, 1'b1);
  and inst70 (inst70_out, display1[5], 1'b1, 1'b1, 1'b1, 1'b1, 1'b1, 1'b1, 1'b1, 1'b1, 1'b1, 1'b1, 1'b1);
  and inst71 (inst71_out, display1[6], inst219_out, 1'b1, 1'b1, 1'b1, 1'b1, 1'b1, 1'b1, 1'b1, 1'b1, 1'b1, 1'b1);
  and inst72 (HEX17_PIN_A16, display1[7], 1'b1, 1'b1, 1'b1, 1'b1, 1'b1, 1'b1, 1'b1, 1'b1, 1'b1, 1'b1, 1'b1);
  counter #(.size(5), .resetvalue(10), .startingvalue(0)) inst276 (
    .clk(inst277_x1), .O(w));  // open: reset, enable, reset_o
  or inst350 (inst350_out, inst286_reset_o, key0, maior);
  counter #(.size(5), .resetvalue(10), .startingvalue(0)) inst286 (
    .clk(inst2_out), .reset(pontos_1bit), .O(r), .reset_o(inst286_reset_o));  // open: enable
  and inst238 (HEX10_PIN_C18, hex10, inst65_out);
  and inst239 (HEX11_PIN_D18, hex11, inst66_out);
  and inst240 (HEX12_PIN_E18, hex12, inst67_out);
  and inst241 (HEX13_PIN_B16, hex13, inst68_out);
  and inst256 (HEX14_PIN_A17, hex14, inst69_out);
  and inst257 (HEX15_PIN_A18, hex15, inst70_out);
  and inst258 (HEX16_PIN_B17, hex16, inst71_out);
  not inst137 (inst137_out, SW6_PIN_A13);
  not inst140 (nome0[6], inst137_out);
  not inst143 (inst143_out, SW5_PIN_B12);
  not inst146 (nome0[5], inst143_out);
  not inst163 (inst163_out, SW4_PIN_A12);
  not inst164 (nome0[4], inst163_out);
  not inst149 (inst149_out, SW3_PIN_C12);
  not inst152 (nome0[3], inst149_out);
  not inst155 (inst155_out, SW2_PIN_D12);
  not inst158 (nome0[2], inst155_out);
  not inst159 (inst159_out, SW1_PIN_C11);
  not inst160 (nome0[1], inst159_out);
  not inst161 (inst161_out, SW0_PIN_C10);
  not inst162 (nome0[0], inst161_out);
  not inst179 (inst179_out, SW6_PIN_A13);
  not inst180 (nome1[6], inst179_out);
  not inst181 (inst181_out, SW5_PIN_B12);
  not inst182 (nome1[5], inst181_out);
  not inst191 (inst191_out, SW4_PIN_A12);
  not inst192 (nome1[4], inst191_out);
  not inst183 (inst183_out, SW3_PIN_C12);
  not inst184 (nome1[3], inst183_out);
  not inst185 (inst185_out, SW2_PIN_D12);
  not inst186 (nome1[2], inst185_out);
  not inst187 (inst187_out, SW1_PIN_C11);
  not inst188 (nome1[1], inst187_out);
  not inst189 (inst189_out, SW0_PIN_C10);
  not inst190 (nome1[0], inst189_out);
  not inst321 (inst321_out, pontos_1bit);
  not inst323 (inst323_out, pontos_1bit);
  and inst95 (inst95_out, w[4], inst166_out);
  and inst102 (inst102_out, w[3], inst166_out);
  and inst105 (inst105_out, w[2], inst166_out);
  and inst107 (inst107_out, w[1], inst166_out);
  and inst168 (inst168_out, w[0], inst166_out);
  not inst166 (inst166_out, pontos_1bit);
  and inst165 (inst165_out, r[4], pontos_1bit);
  and inst167 (inst167_out, r[3], pontos_1bit);
  and inst169 (inst169_out, r[2], pontos_1bit);
  and inst170 (inst170_out, r[1], pontos_1bit);
  and inst172 (inst172_out, r[0], pontos_1bit);
  and inst320 (inst320_out, inst110_out, inst321_out);
  and inst322 (inst322_out, nome, inst323_out);
  or inst175 (\end [4], inst95_out, inst165_out);
  or inst177 (\end [3], inst102_out, inst167_out);
  or inst178 (\end [2], inst105_out, inst169_out);
  or inst234 (\end [1], inst107_out, inst170_out);
  or inst235 (\end [0], inst168_out, inst172_out);
  nome inst108 (.data(nome0), .wren(inst320_out), .address(\end ), .clock(MAX10_CLK1_50_PIN_P11), .q(nome0out));
  nome inst109 (.data(nome1), .wren(inst322_out), .address(\end ), .clock(MAX10_CLK1_50_PIN_P11), .q(nome1out));
  seg inst196 (
    .M(pontos[3]), .N(pontos[2]), .O(pontos[1]), .P(pontos[0]), .a(inst196_a), .b(inst196_b), .c(inst196_c),
    .d(inst196_d), .e(inst196_e), .f(inst196_f), .g(inst196_g));
  or inst220 (inst220_out, a0, perdeu);
  or inst221 (inst221_out, d0, perdeu);
  or inst222 (inst222_out, g0, perdeu);
  not inst337 (inst337_out, pontos_1bit);
  not inst259 (inst259_out, perdeu);
  and inst341 (inst341_out, inst337_out, inst259_out);
  or inst260 (hex00, inst341_out, inst196_a);
  or inst261 (hex01, inst341_out, inst196_b);
  or inst262 (hex02, inst341_out, inst196_c);
  or inst263 (hex03, inst341_out, inst196_d);
  or inst264 (hex04, inst341_out, inst196_e);
  or inst265 (hex05, inst341_out, inst196_f);
  or inst266 (hex06, inst341_out, inst196_g);
  and inst73 (inst73_out, display0[0], inst220_out, 1'b1, 1'b1, 1'b1, 1'b1, 1'b1, 1'b1, 1'b1, 1'b1, 1'b1, 1'b1);
  and inst74 (inst74_out, display0[1], 1'b1, 1'b1, 1'b1, 1'b1, 1'b1, 1'b1, 1'b1, 1'b1, 1'b1, 1'b1, 1'b1);
  and inst75 (inst75_out, display0[2], 1'b1, 1'b1, 1'b1, 1'b1, 1'b1, 1'b1, 1'b1, 1'b1, 1'b1, 1'b1, 1'b1);
  and inst76 (inst76_out, display0[3], inst221_out, 1'b1, 1'b1, 1'b1, 1'b1, 1'b1, 1'b1, 1'b1, 1'b1, 1'b1, 1'b1);
  and inst77 (inst77_out, display0[4], 1'b1, 1'b1, 1'b1, 1'b1, 1'b1, 1'b1, 1'b1, 1'b1, 1'b1, 1'b1, 1'b1);
  and inst78 (inst78_out, display0[5], 1'b1, 1'b1, 1'b1, 1'b1, 1'b1, 1'b1, 1'b1, 1'b1, 1'b1, 1'b1, 1'b1);
  and inst79 (inst79_out, display0[6], inst222_out, 1'b1, 1'b1, 1'b1, 1'b1, 1'b1, 1'b1, 1'b1, 1'b1, 1'b1, 1'b1);
  and inst80 (HEX07_PIN_D15, display0[7], 1'b1, 1'b1, 1'b1, 1'b1, 1'b1, 1'b1, 1'b1, 1'b1, 1'b1, 1'b1, 1'b1);
  and inst267 (HEX00_PIN_C14, hex00, inst73_out);
  and inst268 (HEX01_PIN_E15, hex01, inst74_out);
  and inst269 (HEX02_PIN_C15, hex02, inst75_out);
  and inst270 (HEX03_PIN_C16, hex03, inst76_out);
  and inst271 (HEX04_PIN_E16, hex04, inst77_out);
  and inst272 (HEX05_PIN_D17, hex05, inst78_out);
  and inst273 (HEX06_PIN_C17, hex06, inst79_out);

  assign LEDR0_PIN_A8 = 1'b0;
  assign LEDR1_PIN_A9 = 1'b0;
  assign LEDR2_PIN_A10 = 1'b0;
  assign LEDR3_PIN_B10 = 1'b0;
  assign LEDR4_PIN_D13 = 1'b0;
  assign LEDR5_PIN_C13 = 1'b0;
  assign LEDR6_PIN_E14 = 1'b0;
  assign LEDR7_PIN_D14 = 1'b0;
  assign LEDR8_PIN_A11 = 1'b0;
  assign LEDR9_PIN_B11 = 1'b0;

  // Other names for the same wires on the sheet: 50MHz = MAX10_CLK1_50_PIN_P11; sw0 = SW0_PIN_C10; sw1 = SW1_PIN_C11;
  //   sw2 = SW2_PIN_D12; sw3 = SW3_PIN_C12; sw4 = SW4_PIN_A12; sw5 = SW5_PIN_B12; sw6 = SW6_PIN_A13;
  //   sw7 = SW7_PIN_A14; sw8 = SW8_PIN_B14; sw9 = SW9_PIN_F15
endmodule
